# EAGLE design LCD_boad (EAGLE 6.2)
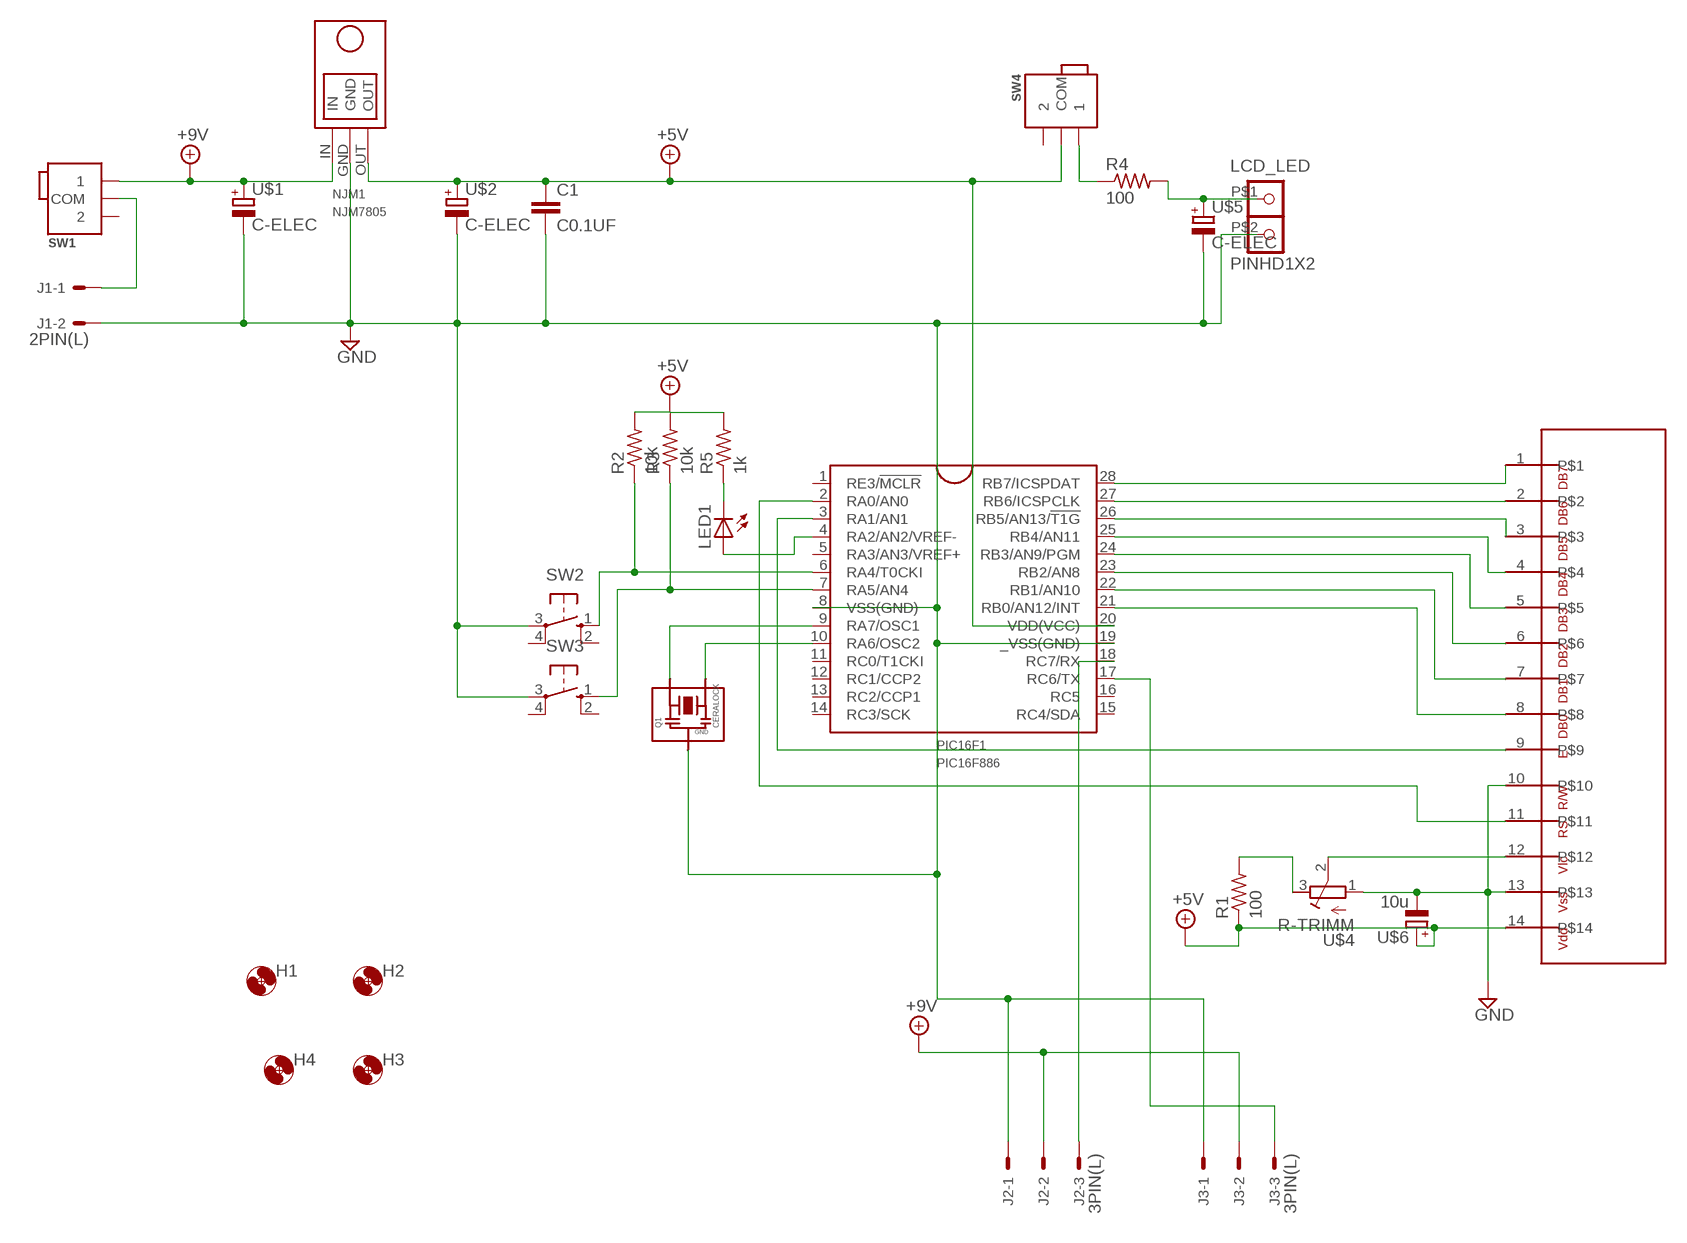
[diagram p0: schematic, sheet 1]

## Parts
C1  C0.1UF  [C0.1UF]
H1  HOLE3.3M3BOLT  [HOLE3.3]
H2  HOLE3.3M3BOLT  [HOLE3.3]
H3  HOLE3.3M3BOLT  [HOLE3.3]
H4  HOLE3.3M3BOLT  [HOLE3.3]
J1  2PIN(L)  [2PL]
J2  3PIN(L)  [3PL]
J3  3PIN(L)  [3PL]
LCD_LED  PINHD1X2  [PINHD1X2]
LED1  LED  [LED5MM]
NJM1  NJM7805  [NJM7805]
PIC16F1  PIC16F886  [DIL28-3]
Q1  CERALOCK  [CERALOCK]
R1  100  R-  [0207/10]
R2  10k  R-  [0207/10]
R3  10k  R-  [0207/10]
R4  100  R-  [0207/10]
R5  1k  R-  [0207/10]
SW1  SWITCH_MININORMAL  [SWITCH_MINI]
SW2  TACTSW  [TACT]
SW3  TACTSW  [TACT]
SW4  SWITCH_MININORMAL  [SWITCH_MINI]
U$1  C-ELEC  [C-6MM]
U$2  C-ELEC  [C-6MM]
U$3  L1672D1JOOO  [Ｌ１６７２Ｄ１Ｊ０００]
U$4  R-TRIMM  [R-TRIMM]
U$5  C-ELEC  [C-6MM]
U$6  10u  C-ELEC  [C-6MM]

## Nets
+5V: C1.1 NJM1.OUT PIC16F1.20(VDD(VCC)) R1.1 R2.2 R3.2 R5.2 SW4.COM U$2.+ U$3.14 U$6.+
+9V: J2.2 J3.2 NJM1.IN SW1.1 U$1.+
GND: C1.2 J1.2 J2.1 J3.1 LCD_LED.P$2 NJM1.GND PIC16F1.8(VSS(GND)) PIC16F1.19(_VSS(GND)) Q1.P$2 SW2.3(P) SW3.3(P) U$1.- U$2.- U$3.10 U$3.13 U$4.1 U$5.- U$6.-
N$1: J1.1 SW1.COM
N$2: J2.3 PIC16F1.18(RC7/RX)
N$3: R1.2 U$4.3
N$4: J3.3 PIC16F1.17(RC6/TX)
N$5: PIC16F1.28(RB7/ICSPDAT) U$3.1
N$6: PIC16F1.27(RB6/ICSPCLK) U$3.2
N$7: PIC16F1.26(RB5/AN13/!T1G) U$3.3
N$8: PIC16F1.25(RB4/AN11) U$3.4
N$9: PIC16F1.24(RB3/AN9/PGM) U$3.5
N$10: PIC16F1.23(RB2/AN8) U$3.6
N$11: PIC16F1.22(RB1/AN10) U$3.7
N$12: PIC16F1.21(RB0/AN12/INT) U$3.8
N$13: PIC16F1.3(RA1/AN1) U$3.9
N$14: PIC16F1.2(RA0/AN0) U$3.11
N$15: U$3.12 U$4.2
N$16: PIC16F1.6(RA4/T0CKI) R2.1 SW2.1(S)
N$17: PIC16F1.7(RA5/AN4) R3.1 SW3.1(S)
N$18: LCD_LED.P$1 R4.2 U$5.+
N$19: R4.1 SW4.1
N$20: LED1.A PIC16F1.4(RA2/AN2/VREF-)
N$21: LED1.K(C) R5.1
N$22: PIC16F1.9(RA7/OSC1) Q1.P$1
N$23: PIC16F1.10(RA6/OSC2) Q1.P$3
Unconnected: PIC16F1.1(RE3/!MCLR) PIC16F1.5(RA3/AN3/VREF+) PIC16F1.11(RC0/T1CKI) PIC16F1.12(RC1/CCP2) PIC16F1.13(RC2/CCP1) PIC16F1.14(RC3/SCK) PIC16F1.15(RC4/SDA) PIC16F1.16(RC5) SW1.2 SW2.2(S1) SW2.4(P1) SW3.2(S1) SW3.4(P1) SW4.2

## Library data of the parts
C1 = FP-21T for MITS:C0.1UF
H1-H4 = FP-21T for MITS:HOLE3.3
J1 = my_connector:2PIN(L)
J2 J3 = my_connector:3PIN(L)
LCD_LED = FP-21T for MITS:PINHD1X2
LED1 = my_led:LED: LED
NJM1 = My_NJM7805:NJM7805
PIC16F1 = FixLib:PIC16F886
Q1 = FP-21T for MITS:CERALOCK: CERALOCK CERAMIC RESONATOR
R1-R5 = My_rcl:R-: Resistor
SW1 SW4 = FP-21T for MITS:SWITCH_MINI: Switch 5.08mm
SW2 SW3 = pushsw:TACTSW
U$1 U$2 U$5 U$6 = My_rcl:C-ELEC
U$3 = LCD_L1672D1J000:L1672D1JOOO
U$4 = My_rcl:R-TRIMM

## Board
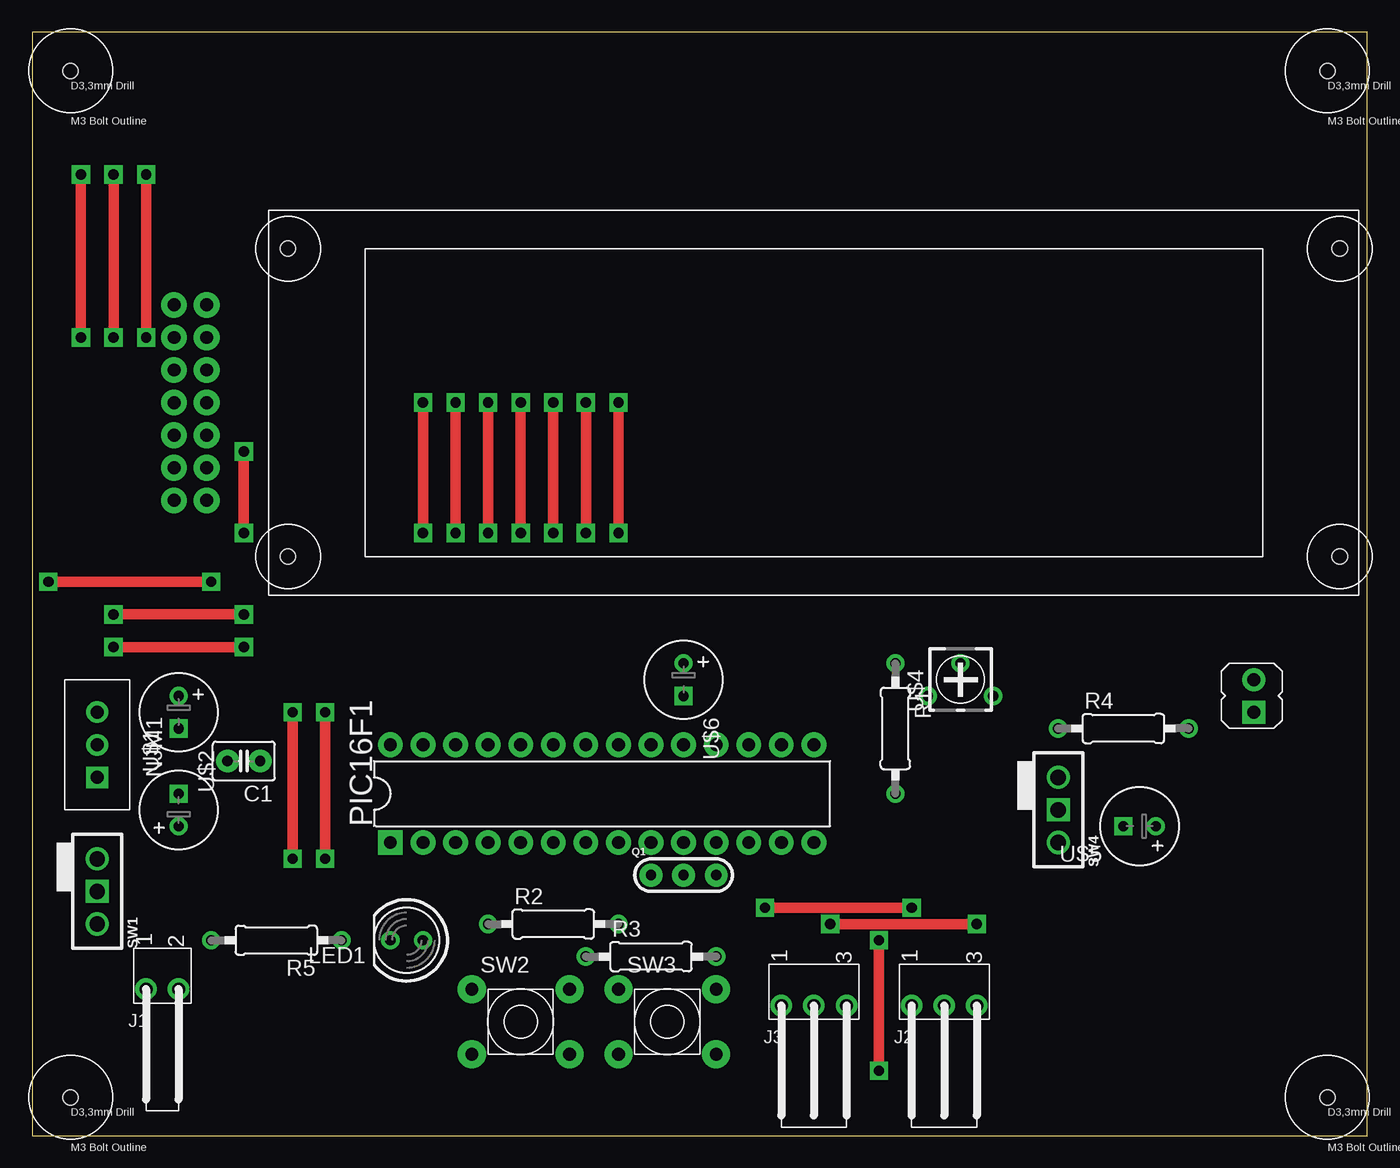
[diagram p1: board, top side]
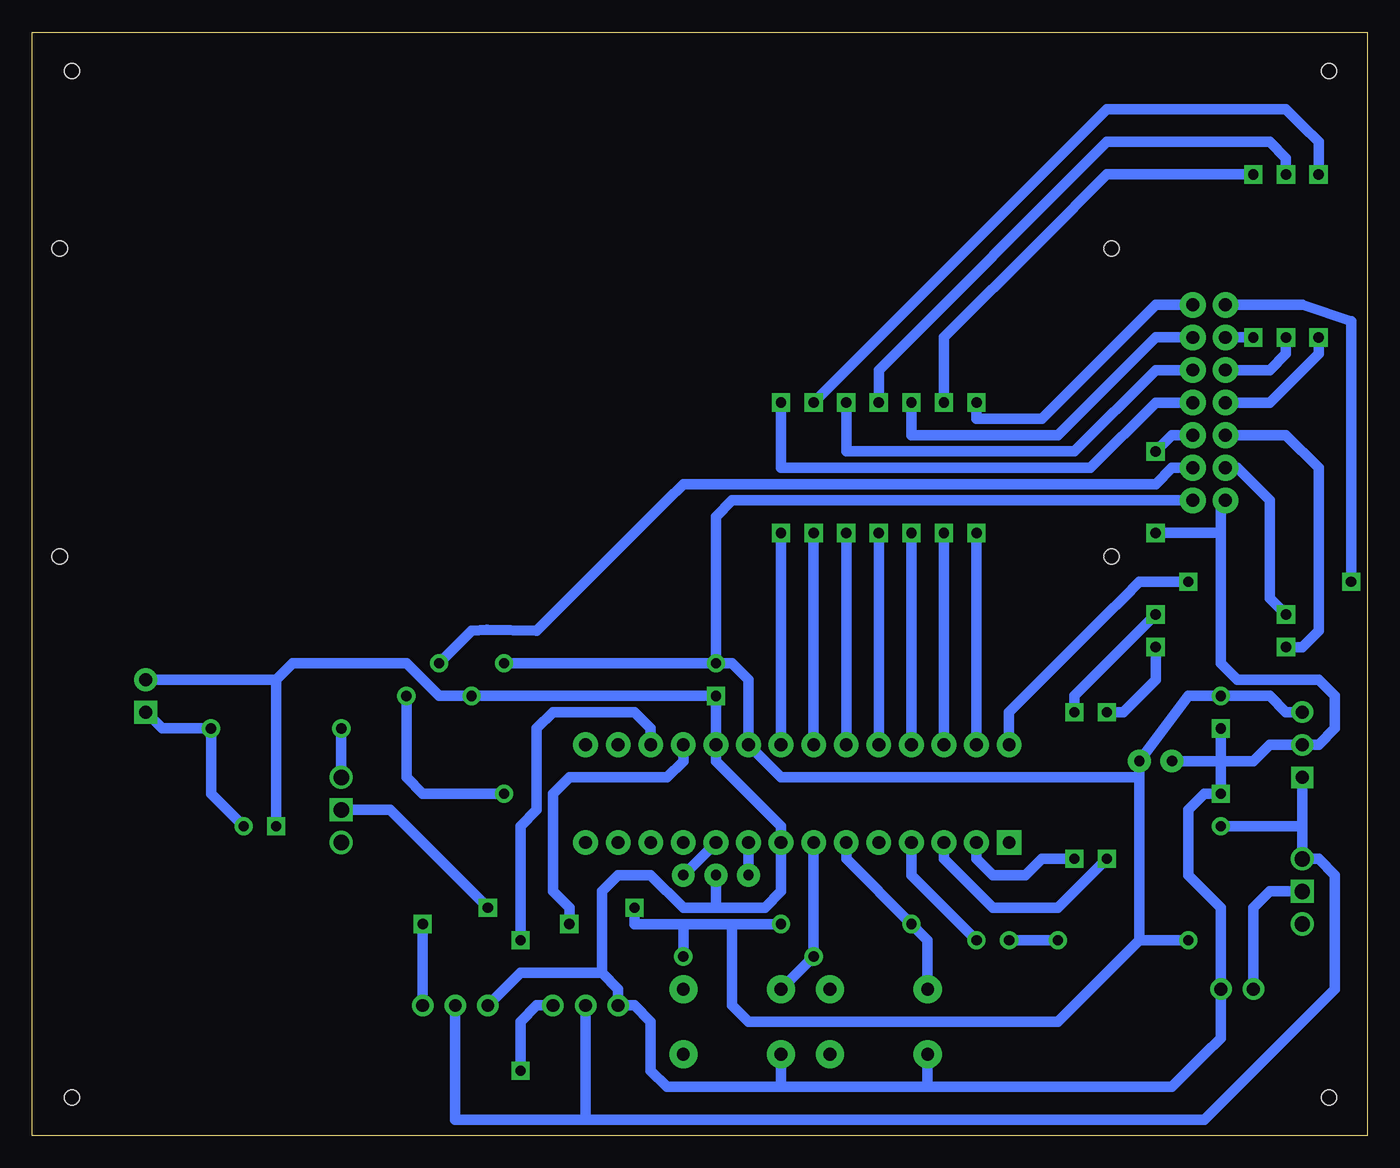
[diagram p2: board, bottom side, seen from below]

Size 104.12 x 86.03 mm. Coordinates in mm from the lower left corner, seen from the top.
Outline: 0,0 104.12,0 104.12,86.03 0,86.03 0,0
Copper layers (1*16): Top 0.035mm / dielectric 1.5mm / Bottom 0.035mm
Design rules: minimum track width 10mil, minimum drill 24mil, track to track 8mil, track to pad 8mil, pad to pad 8mil, via to via 8mil, smd to smd 8mil, copper to edge 40mil, drill to drill 8mil, minimum pad ring 10mil, minimum via ring 8mil, stop-mask expansion 4mil, vias tented up to drill 0mil, thermal gap 10mil

### Footprints (pad centres in the part's own frame; a part is rotated, then mirrored left to right if it is on the bottom)
C0.1UF = drill 0.8 pad 1.778: 1 -1.27,0; 2 1.27,0
HOLE3.3 = hole 1.2: 0,0
2PL = drill 1 pad 1.676: 1 1.27,3.81; 2 -1.27,3.81
3PL = drill 1 pad 1.676: 1 2.54,3.81; 2 0,3.81; 3 -2.54,3.81
PINHD1X2 = drill 1 pad 1.8 square: P$1 0,2.54 | drill 1 pad 1.8: P$2 0,0
LED5MM = drill 0.8 pad 1.422: A -1.27,0; K 1.27,0
NJM7805 = drill 1 pad 1.676: GND 0,0; OUT 2.54,0 | drill 1 pad 1.676 square: IN -2.54,0
DIL28-3 = drill 1 pad 1.93 square: 1 -16.51,-3.81 | drill 1 pad 1.93: 2 -13.97,-3.81; 3 -11.43,-3.81; 4 -8.89,-3.81; 5 -6.35,-3.81; 6 -3.81,-3.81; 7 -1.27,-3.81; 8 1.27,-3.81; 9 3.81,-3.81; 10 6.35,-3.81; 11 8.89,-3.81; 12 11.43,-3.81; 13 13.97,-3.81; 14 16.51,-3.81; 15 16.51,3.81; 16 13.97,3.81; 17 11.43,3.81; 18 8.89,3.81; 19 6.35,3.81; 20 3.81,3.81; 21 1.27,3.81; 22 -1.27,3.81; 23 -3.81,3.81; 24 -6.35,3.81; 25 -8.89,3.81; 26 -11.43,3.81; 27 -13.97,3.81; 28 -16.51,3.81
CERALOCK = drill 0.8 pad 1.778: P$1 -2.54,0; P$2 0,0; P$3 2.54,0
0207/10 = drill 0.8 pad 1.422: 1 -5.08,0; 2 5.08,0
SWITCH_MINI = drill 1.2 pad 1.8: 1 0,2.54; 2 0,-2.54 | drill 1.2 pad 1.8 square: COM 0,0
TACT = drill 1 pad 2.184: 1 -3.81,2.54; 2 3.81,2.54; 3 -3.81,-2.54; 4 3.81,-2.54
C-6MM = drill 0.8 pad 1.422: + -1.27,0 | drill 0.8 pad 1.422 square: - 1.27,0
Ｌ１６７２Ｄ１Ｊ０００ = drill 1 pad 2: 1 -41,7.62; 2 -38.46,7.62; 3 -41,5.08; 4 -38.46,5.08; 5 -41,2.54; 6 -38.46,2.54; 7 -41,0; 8 -38.46,0; 9 -41,-2.54; 10 -38.46,-2.54; 11 -41,-5.08; 12 -38.46,-5.08; 13 -41,-7.62; 14 -38.46,-7.62 | hole 1.2: -32.11,12; 49.89,12; 49.89,-12; -32.11,-12
R-TRIMM = drill 0.8 pad 1.422: 1 -2.54,-1.27; 2 0,1.27; 3 2.54,-1.27

### Placement (x,y rotation side)
C1  16.51,29.21 180 top
H1  3,3 0 top
H2  3,83 0 top
H3  101,3 0 top
H4  101,83 0 top
J1  10.16,15.24 180 top
J2  71.12,13.97 180 top
J3  60.96,13.97 180 top
LCD_LED  95.25,35.56 180 top
LED1  29.21,15.24 180 top
NJM1  5.08,30.48 90 top
PIC16F1  44.45,26.67 0 top
Q1  50.8,20.32 0 top
R1  67.31,31.75 270 top
R2  40.64,16.51 0 top
R3  48.26,13.97 0 top
R4  85.09,31.75 0 top
R5  19.05,15.24 180 top
SW1  5.08,19.05 0 top
SW2  38.1,8.89 0 top
SW3  49.53,8.89 0 top
SW4  80.01,25.4 0 top
U$1  11.43,25.4 90 top
U$2  11.43,33.02 270 top
U$3  52.07,57.15 0 top
U$4  72.39,35.56 0 top
U$5  86.36,24.13 180 top
U$6  50.8,35.56 270 top

### Tracks (layer width: path | path; a pad name or v marks a point on that pad's centre or on a via)
+5V  (via drill 0.8 pad 1.42)
  Top 0.813: v57.15,17.78 v68.58,17.78
  Bottom 0.813: 49.53,16.51 R2.2 49.53,16.51 | 49.53,16.51 53.34,16.51 | 53.34,16.51 53.34,15.24 | NJM1.OUT 6.35,33.02 7.62,34.29 U$2.+ 13.97,34.29 C1.1 | C1.1 17.78,27.94 | 17.78,27.94 17.78,26.67 | 17.78,26.67 17.78,15.24 | 17.78,15.24 R5.2 | C1.1 17.78,27.94 | 17.78,27.94 17.78,26.67 | 17.78,26.67 17.78,27.94 | 17.78,27.94 45.72,27.94 PIC16F1.20 48.26,35.56 49.53,36.83 U$6.+ | 49.53,16.51 53.34,16.51 | 53.34,16.51 53.34,15.24 | 53.34,15.24 R3.2 | 17.78,15.24 24.13,8.89 48.26,8.89 49.53,10.16 49.53,16.51 | v68.58,17.78 76.2,25.4 78.74,25.4 SW4.COM | U$6.+ R1.1 | U$3.14 49.53,49.53 50.8,48.26 U$6.+ | 53.34,16.51 57.15,16.51 v57.15,17.78
+9V
  Bottom 0.813: SW1.1 5.08,24.13 | 5.08,24.13 U$1.+ | U$1.+ 5.08,24.13 | 5.08,24.13 NJM1.IN 5.08,24.13 | 5.08,24.13 U$1.+ | U$1.+ 5.08,24.13 | 5.08,24.13 SW1.1 | SW1.1 3.81,21.59 2.54,20.32 2.54,11.43 12.7,1.27 60.96,1.27 | 60.96,1.27 69.85,1.27 | 69.85,1.27 71.12,1.27 | 71.12,1.27 69.85,1.27 | 69.85,1.27 71.12,1.27 | 71.12,1.27 J2.2 | J3.2 60.96,1.27
GND  (via drill 0.8 pad 1.42)
  Top 0.813: v16.51,53.34 v16.51,46.99
  Bottom 0.813: U$2.- 11.43,30.48 | 11.43,30.48 11.43,29.21 | U$2.- 11.43,30.48 | 11.43,30.48 11.43,29.21 | 11.43,29.21 C1.2 11.43,29.21 | U$2.- 11.43,30.48 | 11.43,46.99 11.43,36.83 10.16,35.56 3.81,35.56 2.54,34.29 2.54,31.75 3.81,30.48 NJM1.GND 7.62,30.48 8.89,29.21 11.43,29.21 | 11.43,46.99 11.43,49.17 U$3.13 | U$3.10 15.24,54.61 v16.51,53.34 | v16.51,46.99 11.43,46.99 | 45.72,24.13 PIC16F1.8 | PIC16F1.8 45.72,24.13 | 45.72,24.13 50.8,29.21 PIC16F1.19 50.8,31.75 U$6.- U$4.1 71.12,34.29 72.39,34.29 74.93,36.83 83.82,36.83 85.09,35.56 | 34.29,3.81 15.24,3.81 12.7,6.35 11.43,7.62 J1.2 11.43,17.78 13.97,20.32 13.97,25.4 12.7,26.67 U$1.- 11.43,29.21 | 34.29,3.81 45.72,3.81 | 45.72,3.81 SW3.3 | SW2.3 34.29,3.81 | SW3.3 45.72,3.81 | 45.72,3.81 54.61,3.81 | 54.61,3.81 55.88,5.08 | 55.88,5.08 55.88,8.89 | 55.88,8.89 57.15,10.16 | 57.15,10.16 J3.1 | 85.09,35.56 U$5.- | 85.09,35.56 LCD_LED.P$2 | U$2.- 11.43,29.21 | J3.1 58.42,11.43 | 58.42,11.43 59.69,12.7 | 59.69,12.7 66.04,12.7 J2.1 | SW3.3 45.72,3.81 | 45.72,3.81 54.61,3.81 | 54.61,3.81 55.88,5.08 | 55.88,5.08 55.88,8.89 | 55.88,8.89 57.15,10.16 | 57.15,10.16 J3.1 | J3.1 58.42,11.43 | 58.42,11.43 59.69,12.7 | PIC16F1.8 45.72,19.05 46.99,17.78 50.8,17.78 | 50.8,17.78 53.34,17.78 55.88,20.32 58.42,20.32 59.69,19.05 59.69,12.7 | Q1.P$2 50.8,17.78
N$1
  Bottom 0.813: J1.1 8.89,17.78 7.62,19.05 SW1.COM
N$2  (via drill 0.8 pad 1.42)
  Top 0.813: v62.23,16.51 v73.66,16.51
  Bottom 0.813: PIC16F1.18 53.34,29.21 54.61,27.94 59.69,27.94 62.23,27.94 63.5,26.67 63.5,24.13 63.5,19.05 62.23,17.78 v62.23,16.51 | v73.66,16.51 J2.3
N$3
  Bottom 0.813: R1.2 73.66,26.67 74.93,27.94 U$4.3
N$4  (via drill 0.8 pad 1.42)
  Top 0.813: v66.04,15.24 v66.04,5.08
  Bottom 0.813: PIC16F1.17 55.88,31.75 57.15,33.02 63.5,33.02 64.77,31.75 64.77,26.67 64.77,25.4 66.04,24.13 66.04,17.78 v66.04,15.24 | v66.04,5.08 66.04,8.89 64.77,10.16 J3.3
N$5  (via drill 0.8 pad 1.42)
  Top 0.813: v13.97,43.18 v1.27,43.18
  Bottom 0.813: PIC16F1.28 27.94,33.02 20.32,40.64 19.05,41.91 17.78,43.18 v13.97,43.18 | v1.27,43.18 1.27,63.5 5.08,64.77 U$3.1
N$6  (via drill 0.8 pad 1.42)
  Top 0.813: v30.48,57.15 v30.48,46.99
  Bottom 0.813: U$3.2 16.51,64.77 25.4,55.88 30.48,55.88 v30.48,57.15 | v30.48,46.99 PIC16F1.27
N$7  (via drill 0.8 pad 1.42)
  Top 0.813: v8.89,62.23 v8.89,74.93 | v33.02,57.15 v33.02,46.99
  Bottom 0.813: U$3.3 v8.89,62.23 | v8.89,74.93 20.32,74.93 25.4,69.85 33.02,62.23 v33.02,57.15 | v33.02,46.99 PIC16F1.26
N$8  (via drill 0.8 pad 1.42)
  Top 0.813: v35.56,57.15 v35.56,46.99
  Bottom 0.813: U$3.4 16.51,62.23 24.13,54.61 35.56,54.61 v35.56,57.15 | v35.56,46.99 PIC16F1.25
N$9  (via drill 0.8 pad 1.42)
  Top 0.813: v6.35,62.23 v6.35,74.93 | v38.1,57.15 v38.1,46.99
  Bottom 0.813: U$3.5 11.43,59.69 7.62,59.69 6.35,60.96 v6.35,62.23 | v38.1,57.15 38.1,59.69 20.32,77.47 7.62,77.47 6.35,76.2 v6.35,74.93 | v38.1,46.99 PIC16F1.24
N$10  (via drill 0.8 pad 1.42)
  Top 0.813: v40.64,57.15 v40.64,46.99
  Bottom 0.813: U$3.6 16.51,59.69 22.86,53.34 40.64,53.34 v40.64,57.15 | v40.64,46.99 PIC16F1.23
N$11  (via drill 0.8 pad 1.42)
  Top 0.813: v3.81,62.23 v3.81,74.93 | v43.18,57.15 v43.18,46.99
  Bottom 0.813: U$3.7 7.62,57.15 3.81,60.96 v3.81,62.23 | v3.81,74.93 3.81,77.47 5.08,78.74 6.35,80.01 20.32,80.01 v43.18,57.15 | v43.18,46.99 PIC16F1.22
N$12  (via drill 0.8 pad 1.42)
  Top 0.813: v45.72,57.15 v45.72,46.99
  Bottom 0.813: U$3.8 16.51,57.15 21.59,52.07 45.72,52.07 v45.72,57.15 | v45.72,46.99 PIC16F1.21
N$13  (via drill 0.8 pad 1.42)
  Top 0.813: v20.32,21.59 v20.32,33.02 | v16.51,38.1 v6.35,38.1
  Bottom 0.813: 24.13,17.78 22.86,19.05 | v20.32,33.02 19.05,33.02 16.51,35.56 v16.51,38.1 | 10.16,54.61 U$3.9 6.35,54.61 3.81,52.07 3.81,39.37 5.08,38.1 v6.35,38.1 | v20.32,21.59 24.13,17.78 | 24.13,17.78 29.21,17.78 33.02,21.59 PIC16F1.3
N$14  (via drill 0.8 pad 1.42)
  Top 0.813: v22.86,21.59 v22.86,33.02 | v16.51,40.64 v6.35,40.64
  Bottom 0.813: PIC16F1.2 30.48,21.59 29.21,20.32 26.67,20.32 25.4,21.59 v22.86,21.59 | v22.86,33.02 22.86,34.29 v16.51,40.64 | U$3.11 10.16,52.07 7.62,49.53 7.62,45.72 | 7.62,45.72 7.62,41.91 | 7.62,41.91 v6.35,40.64 7.62,41.91 | 7.62,41.91 7.62,45.72
N$15
  Bottom 0.813: U$4.2 69.85,39.37 68.64,39.43 64.78,39.37 64.77,39.37 54.61,49.53 53.34,50.8 16.51,50.8 15.24,52.07 U$3.12
N$16
  Bottom 0.813: SW2.1 34.29,15.24 R2.1 40.64,21.59 PIC16F1.6
N$17
  Bottom 0.813: PIC16F1.7 43.18,20.32 43.18,16.51 R3.1 SW3.1
N$18
  Bottom 0.813: U$5.+ 90.17,26.67 R4.2 93.98,31.75 LCD_LED.P$1
N$19
  Bottom 0.813: SW4.1 R4.1
N$20
  Bottom 0.813: PIC16F1.4 35.56,21.59 35.56,20.32 LED1.A
N$21
  Bottom 0.813: LED1.K R5.1
N$22
  Bottom 0.813: Q1.P$1 PIC16F1.9
N$23
  Bottom 0.813: PIC16F1.10 Q1.P$3